# EAGLE design iobuf (EAGLE 7.2.0)
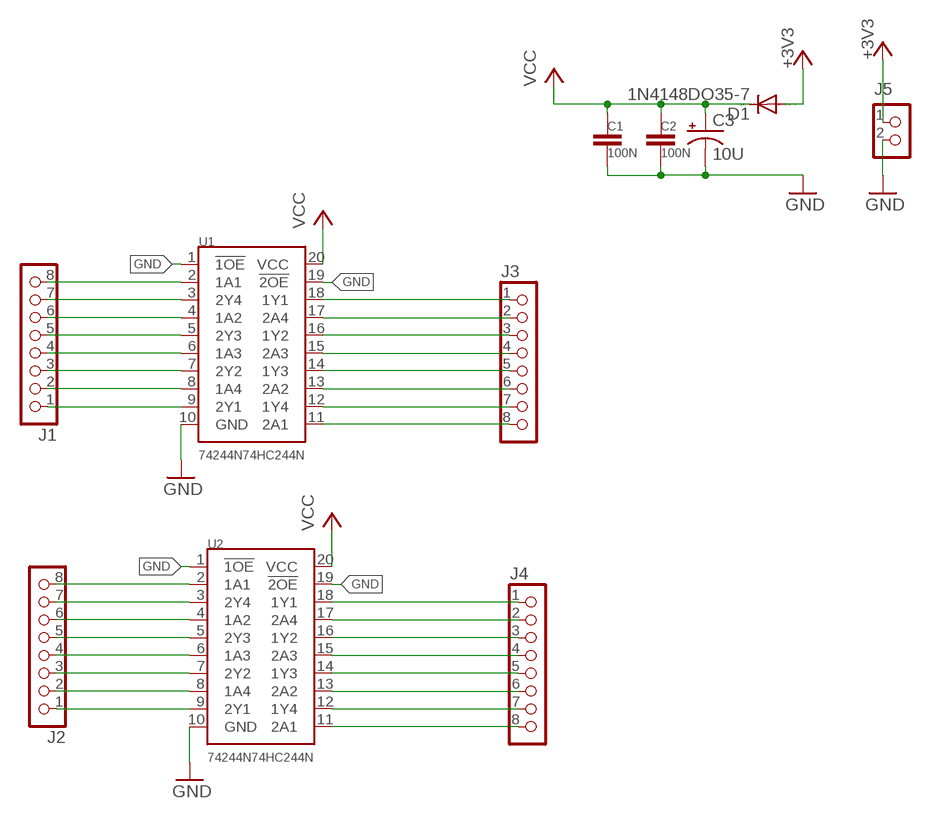
[diagram p0: schematic, sheet 1]

## Parts
C1  100N  C-EU025-025X050  [C025-025X050]
C2  100N  C-EU025-025X050  [C025-025X050]
C3  10U  CPOL-USE2.5-7  [E2,5-7]
D1  1N4148DO35-7  [DO35-7]
J1  CON_HEADER_1X08-PTH  [M1X8]
J2  CON_HEADER_1X08-PTH  [M1X8]
J3  CON_HEADER_1X08-PTH  [M1X8]
J4  CON_HEADER_1X08-PTH  [M1X8]
J5  CON_HEADER_1X02-PTH  [M1X2]
U1  74244N74HC244N  [DIL20]
U2  74244N74HC244N  [DIL20]

## Nets
+3V3: D1.A J5.1
GND: C1.2 C2.2 C3.- J5.2 U1.1(!1OE) U1.10(GND) U1.19(!2OE) U2.1(!1OE) U2.10(GND) U2.19(!2OE)
N$1: J1.1 U1.9(2Y1)
N$2: J1.2 U1.8(1A4)
N$3: J1.3 U1.7(2Y2)
N$4: J1.4 U1.6(1A3)
N$5: J1.5 U1.5(2Y3)
N$6: J1.6 U1.4(1A2)
N$7: J1.7 U1.3(2Y4)
N$8: J1.8 U1.2(1A1)
N$9: J3.8 U1.11(2A1)
N$10: J3.7 U1.12(1Y4)
N$11: J3.6 U1.13(2A2)
N$12: J3.5 U1.14(1Y3)
N$13: J3.4 U1.15(2A3)
N$14: J3.3 U1.16(1Y2)
N$15: J3.2 U1.17(2A4)
N$16: J3.1 U1.18(1Y1)
N$17: J2.1 U2.9(2Y1)
N$18: J2.2 U2.8(1A4)
N$19: J2.3 U2.7(2Y2)
N$20: J2.4 U2.6(1A3)
N$21: J2.5 U2.5(2Y3)
N$22: J2.6 U2.4(1A2)
N$23: J2.7 U2.3(2Y4)
N$24: J2.8 U2.2(1A1)
N$25: J4.8 U2.11(2A1)
N$26: J4.7 U2.12(1Y4)
N$27: J4.6 U2.13(2A2)
N$28: J4.5 U2.14(1Y3)
N$29: J4.4 U2.15(2A3)
N$30: J4.3 U2.16(1Y2)
N$31: J4.2 U2.17(2A4)
N$32: J4.1 U2.18(1Y1)
VCC: C1.1 C2.1 C3.+ D1.C U1.20(VCC) U2.20(VCC)

## Library data of the parts
C1 C2 = rcl:C-EU: CAPACITOR, European symbol
C3 = rcl:CPOL-US: POLARIZED CAPACITOR, American symbol
D1 = diode:1N4148: DIODE high speed (Philips)
J1-J4 = bb_pinheader:CON_HEADER_1X08
J5 = bb_pinheader:CON_HEADER_1X02
U1 U2 = bb_74:74244N

## Board
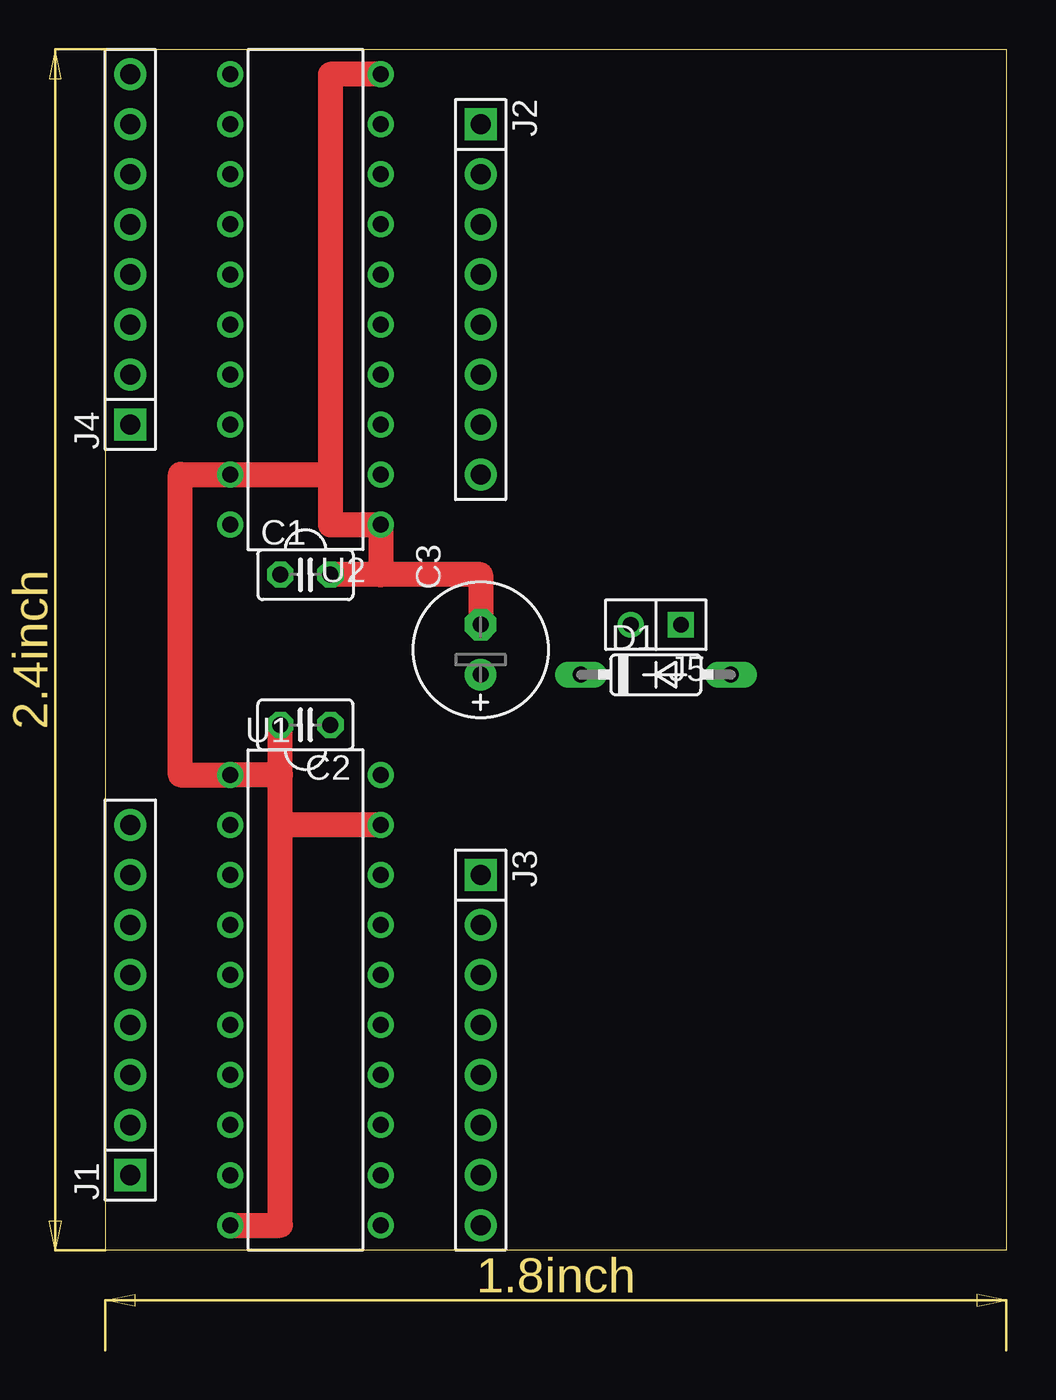
[diagram p1: board, top side]
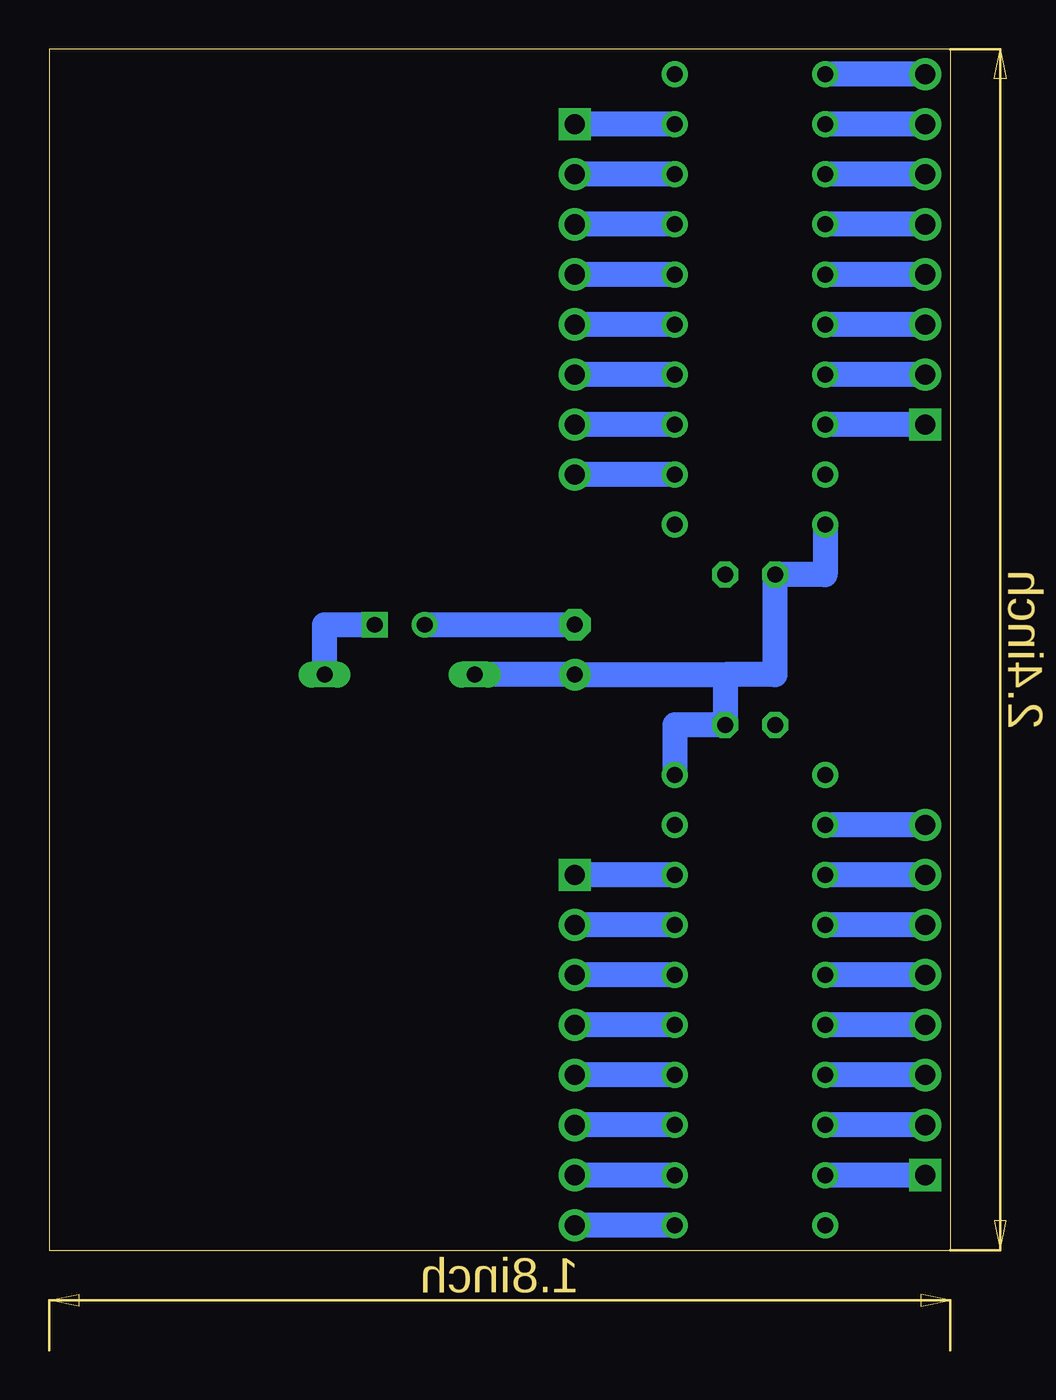
[diagram p2: board, bottom side, seen from below]

Size 45.72 x 60.96 mm. Coordinates in mm from the lower left corner, seen from the top.
Outline: 0,60.96 0,0 45.72,0 45.72,60.96 0,60.96
Copper layers (1*16): Top 0.035mm / dielectric 1.5mm / Bottom 0.035mm
Design rules "default": minimum track width 10mil, minimum drill 24mil, track to track 8mil, track to pad 8mil, pad to pad 8mil, via to via 8mil, smd to smd 8mil, copper to edge 40mil, drill to drill 8mil, minimum pad ring 10mil, minimum via ring 8mil, stop-mask expansion 4mil, vias tented up to drill 0mil, thermal gap 10mil

### Footprints (pad centres in the part's own frame; a part is rotated, then mirrored left to right if it is on the bottom)
C025-025X050 = drill 0.813 octagon: 1 -1.27,0; 2 1.27,0
E2,5-7 = drill 0.813 pad 1.6: + -1.27,0 | drill 0.813 pad 1.6 octagon: - 1.27,0
DO35-7 = drill 0.813 long: A 3.81,0; C -3.81,0
M1X8 = drill 1.02 pad 1.632 square: 1 -8.89,0 | drill 1.02 pad 1.632: 2 -6.35,0; 3 -3.81,0; 4 -1.27,0; 5 1.27,0; 6 3.81,0; 7 6.35,0; 8 8.89,0
M1X2 = drill 0.8 square: 1 -1.27,0 | drill 0.8: 2 1.27,0
DIL20 = drill 0.813: 1 -11.43,-3.81; 2 -8.89,-3.81; 3 -6.35,-3.81; 4 -3.81,-3.81; 5 -1.27,-3.81; 6 1.27,-3.81; 7 3.81,-3.81; 8 6.35,-3.81; 9 8.89,-3.81; 10 11.43,-3.81; 11 11.43,3.81; 12 8.89,3.81; 13 6.35,3.81; 14 3.81,3.81; 15 1.27,3.81; 16 -1.27,3.81; 17 -3.81,3.81; 18 -6.35,3.81; 19 -8.89,3.81; 20 -11.43,3.81

### Placement (x,y rotation side)
C1  10.16,34.29 0 top
C2  10.16,26.67 180 top
C3  19.05,30.48 90 top
D1  27.94,29.21 0 top
J1  1.27,12.7 90 top
J2  19.05,48.26 270 top
J3  19.05,10.16 270 top
J4  1.27,50.8 90 top
J5  27.94,31.75 180 top
U1  10.16,12.7 270 top
U2  10.16,48.26 90 top

### Tracks (layer width: path | path; a pad name or v marks a point on that pad's centre or on a via)
+3V3
  Bottom 1.27: D1.A 31.75,31.75 J5.1
GND
  Top 1.27: U1.10 8.89,1.27 8.89,21.59 | 8.89,24.13 U1.1 3.81,24.13 3.81,39.37 U2.19 11.43,39.37 | U1.19 8.89,21.59 | 8.89,21.59 8.89,24.13 | U2.10 11.43,59.69 11.43,39.37 | 11.43,39.37 11.43,36.83 U2.1 13.97,34.29 | 8.89,24.13 C2.2 | C3.- 19.05,34.29 13.97,34.29 | 13.97,34.29 C1.2
  Bottom 1.27: J5.2 C3.-
N$1
  Bottom 1.27: J1.1 U1.9
N$2
  Bottom 1.27: J1.2 U1.8
N$3
  Bottom 1.27: J1.3 U1.7
N$4
  Bottom 1.27: J1.4 U1.6
N$5
  Bottom 1.27: J1.5 U1.5
N$6
  Bottom 1.27: J1.6 U1.4
N$7
  Bottom 1.27: J1.7 U1.3
N$8
  Bottom 1.27: J1.8 U1.2
N$9
  Bottom 1.27: U1.11 J3.8
N$10
  Bottom 1.27: U1.12 J3.7
N$11
  Bottom 1.27: U1.13 J3.6
N$12
  Bottom 1.27: U1.14 J3.5
N$13
  Bottom 1.27: U1.15 J3.4
N$14
  Bottom 1.27: U1.16 J3.3
N$15
  Bottom 1.27: U1.17 J3.2
N$16
  Bottom 1.27: U1.18 J3.1
N$17
  Bottom 1.27: U2.9 J2.1
N$18
  Bottom 1.27: U2.8 J2.2
N$19
  Bottom 1.27: U2.7 J2.3
N$20
  Bottom 1.27: U2.6 J2.4
N$21
  Bottom 1.27: U2.5 J2.5
N$22
  Bottom 1.27: U2.4 J2.6
N$23
  Bottom 1.27: U2.3 J2.7
N$24
  Bottom 1.27: U2.2 J2.8
N$25
  Bottom 1.27: J4.8 U2.11
N$26
  Bottom 1.27: J4.7 U2.12
N$27
  Bottom 1.27: J4.6 U2.13
N$28
  Bottom 1.27: J4.5 U2.14
N$29
  Bottom 1.27: J4.4 U2.15
N$30
  Bottom 1.27: J4.3 U2.16
N$31
  Bottom 1.27: J4.2 U2.17
N$32
  Bottom 1.27: J4.1 U2.18
VCC
  Bottom 1.27: U1.20 13.97,26.67 C2.1 11.43,29.21 | 11.43,29.21 8.89,29.21 C1.1 6.35,34.29 U2.20 | 11.43,29.21 C3.+ D1.C